# Altium schematic sheet Capstone_Signal_Conditioners_Final_Schematic.SchDoc
size A; SheetNumber: 1; SheetTotal: 5
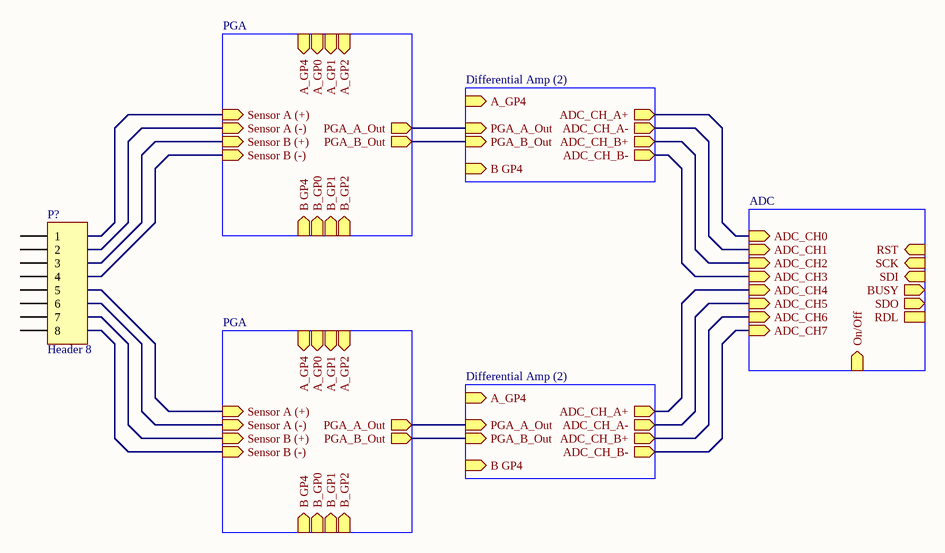
[diagram p0: Capstone_Signal_Conditioners_Final_Schematic.SchDoc]

## Parts
P?  Header 8  [HDR1X8]

## Sub-sheets
ADC = LTC2373_Schematic.SchDoc: ADC_CH0 (in), ADC_CH1 (in), ADC_CH2 (in), ADC_CH3 (in), ADC_CH4 (in), ADC_CH5 (in), ADC_CH6 (in), ADC_CH7 (in), RST (in), SDO (out), SCK (in), SDI (in), BUSY (out), RDL, On/Off (in)
Differential Amp (2) = LTC6362_Schematic.SchDoc: PGA_A_Out (in), PGA_B_Out (in), A_GP4 (in), B GP4 (in), ADC_CH_A+ (out), ADC_CH_A- (out), ADC_CH_B- (out), ADC_CH_B+ (out)
Differential Amp (2) = LTC6362_Schematic.SchDoc: PGA_A_Out (in), PGA_B_Out (in), A_GP4 (in), B GP4 (in), ADC_CH_A+ (out), ADC_CH_A- (out), ADC_CH_B- (out), ADC_CH_B+ (out)
PGA = THS7002CPWP_Schematic.SchDoc: Sensor A (+) (in), Sensor A (-) (in), Sensor B (+) (in), Sensor B (-) (in), A_GP0 (in), A_GP1 (in), A_GP2 (in), PGA_A_Out (out), PGA_B_Out (out), B_GP0 (in), B_GP1 (in), B_GP2 (in), A_GP4 (in), B GP4 (in)
PGA = THS7002CPWP_Schematic.SchDoc: Sensor A (+) (in), Sensor A (-) (in), Sensor B (+) (in), Sensor B (-) (in), A_GP0 (in), A_GP1 (in), A_GP2 (in), PGA_A_Out (out), PGA_B_Out (out), B_GP0 (in), B_GP1 (in), B_GP2 (in), A_GP4 (in), B GP4 (in)

## Nets
(unnamed): sheet PGA/PGA_A_Out, sheet Differential Amp (2)/PGA_A_Out
(unnamed): sheet PGA/PGA_B_Out, sheet Differential Amp (2)/PGA_B_Out
(unnamed): sheet Differential Amp (2)/ADC_CH_A+, sheet ADC/ADC_CH0
(unnamed): sheet Differential Amp (2)/ADC_CH_A-, sheet ADC/ADC_CH1
(unnamed): sheet Differential Amp (2)/ADC_CH_B-, sheet ADC/ADC_CH3
(unnamed): sheet Differential Amp (2)/ADC_CH_B+, sheet ADC/ADC_CH2
(unnamed): sheet PGA/PGA_A_Out, sheet Differential Amp (2)/PGA_A_Out
(unnamed): sheet PGA/PGA_B_Out, sheet Differential Amp (2)/PGA_B_Out
(unnamed): sheet Differential Amp (2)/ADC_CH_A+, sheet ADC/ADC_CH4
(unnamed): sheet Differential Amp (2)/ADC_CH_A-, sheet ADC/ADC_CH5
(unnamed): sheet Differential Amp (2)/ADC_CH_B-, sheet ADC/ADC_CH7
(unnamed): sheet Differential Amp (2)/ADC_CH_B+, sheet ADC/ADC_CH6

Not connected (* = marked no-connect by the designer): P? 1 2 3 4 5 6 7 8

## Library data of the parts
P? = Header 8: Header, 8-Pin; LatestRevisionDate: 17-Jul-2002; LatestRevisionNote: Re-released for DXP Platform.; Publisher: Altium Limited